# Altium project SMART_WATCH_BOT.PrjPcb
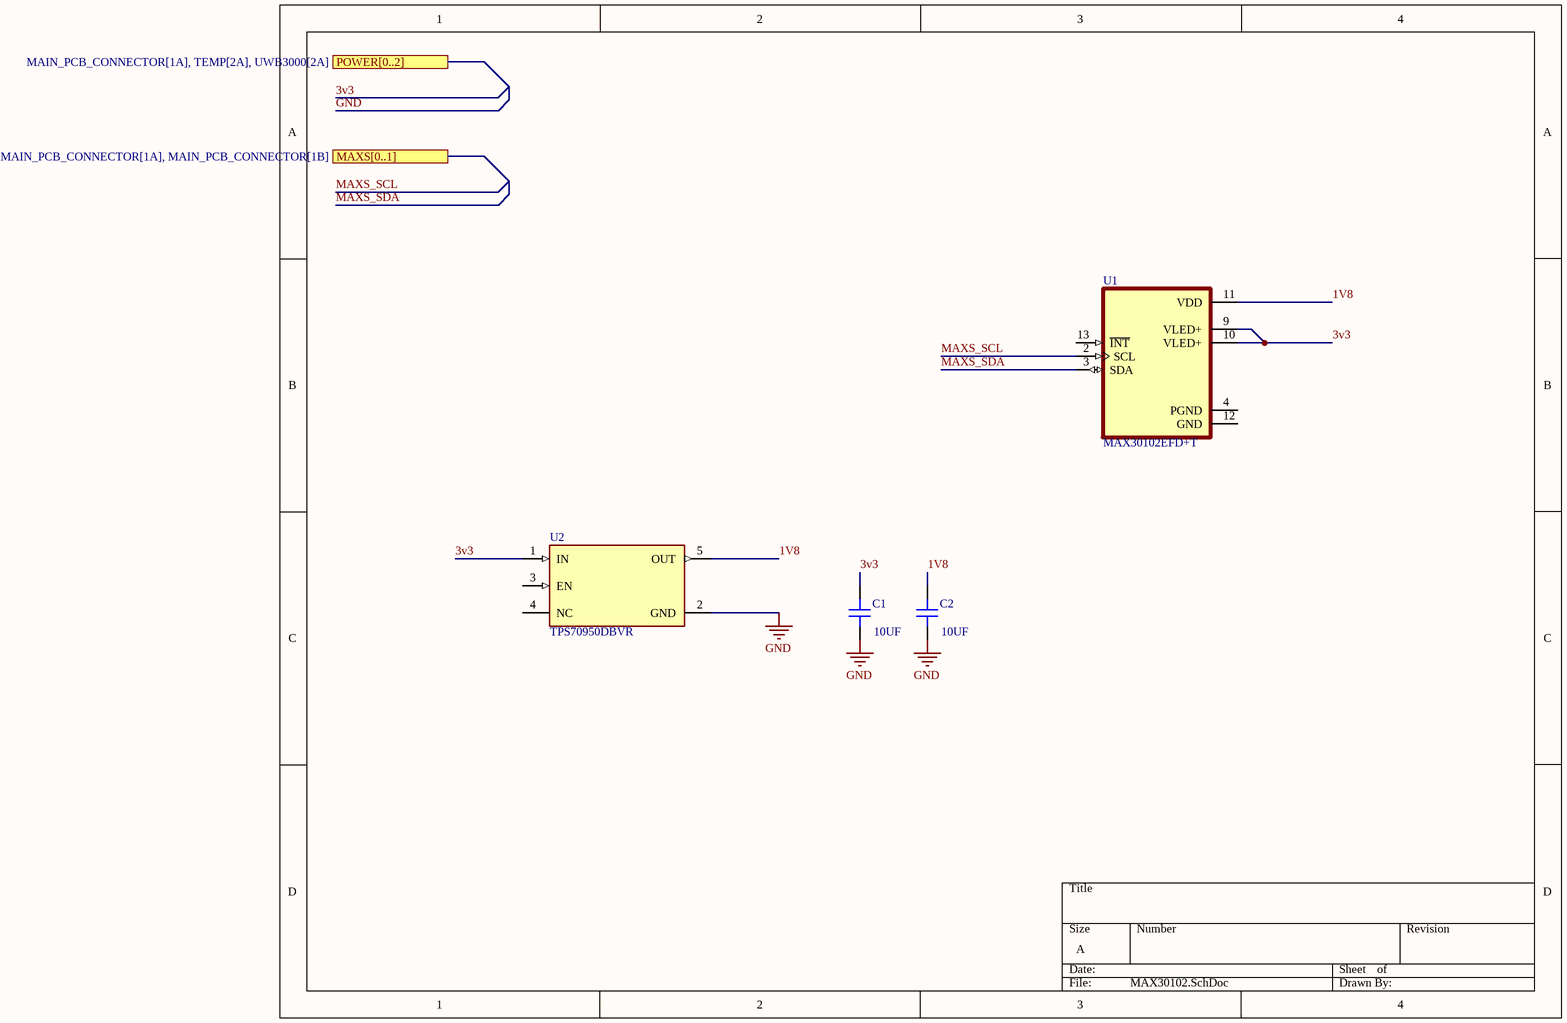
[diagram p0: MAX30102.SchDoc]
4 sheets, 14 parts. Net scope: global (net labels, ports and power ports of the same name join across sheets).
Board file: PCB2.PcbDoc
Sheets:
  MAX30102.SchDoc
  MAIN_PCB_CONNECTOR.SchDoc
  UWB3000.SchDoc
  TEMP.SchDoc

## Sheet MAX30102.SchDoc
size A; SheetNumber: 1; SheetTotal: 4

### Parts
C1  10UF  [CAP 0402_1005]
C2  10UF  [CAP 0402_1005]
U1  MAX30102EFD+T  [XDCR_MAX30101EFD+]
U2  TPS70950DBVR  [SOT95P280X145-5N]

### Ports
MAXS[0..1] (see MAIN_PCB_CONNECTOR[1A], MAIN_PCB_CONNECTOR[1B]), POWER[0..2] (see MAIN_PCB_CONNECTOR[1A], TEMP[2A], UWB3000[2A])

### Nets
GND: C1.1 C2.1 U2.2(GND)
1V8: C2.2 U1.11(VDD) U2.5(OUT)
3v3: C1.2 U1.9(VLED+) U1.10(VLED+) U2.1(IN)
MAXS_SCL: U1.2(SCL)
MAXS_SDA: U1.3(SDA)

Not connected (* = marked no-connect by the designer): U1 4(PGND) 12(GND) 13(~{INT}); U2 3(EN) 4(NC)

### Library data of the parts
C1 C2 = 0402X106M6R3CT: CAP CER 10UF 6.3V X5R 0402; MFR.Part #: CL05A106MQ5NUNC; Manufacturer: Samsung Electro-Mechanics; JLCPCB Part #: C15525; value: 10UF
U1 = MAX30102EFD+T: Pulse Oximeter and Heart Rate Sensor Digital Output; Manufacturer: Analog Devices Inc./Maxim Integrated; JLCPCB Part #: C6454833; MFR.Part #: MAX30102EFD+T
U2 = TPS70950DBVR: Manufacturer: Texas Instruments; JLCPCB Part #: C96028; MFR.Part #: TPS70950DBVR

## Sheet MAIN_PCB_CONNECTOR.SchDoc
size A; SheetNumber: 2; SheetTotal: 4
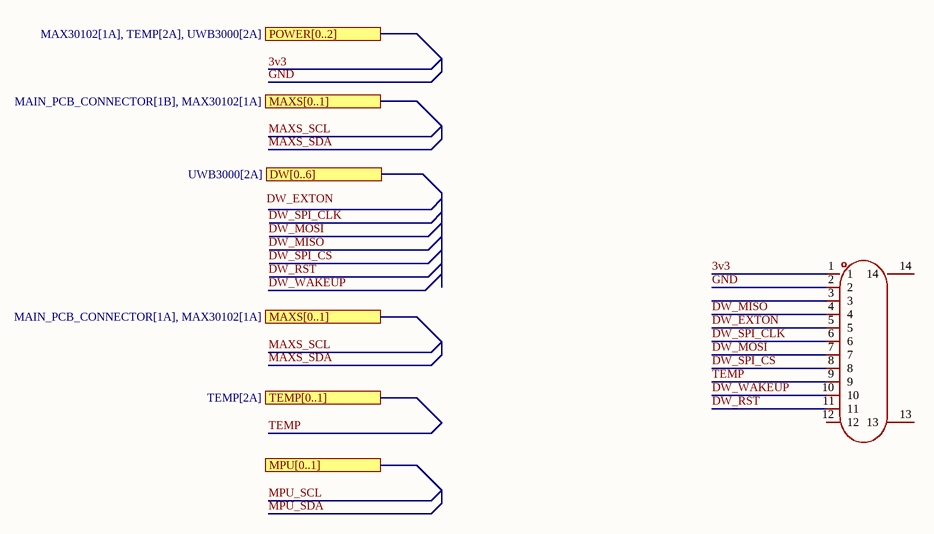
[diagram p1: MAIN_PCB_CONNECTOR.SchDoc]

### Parts
FPC1  FH12-12S-0.5SH(55)  [FPC-SMD_FH12-12S-0.5SH-55]  (value not drawn)

### Ports
DW[0..6] (see UWB3000[2A]), MAXS[0..1] (see MAIN_PCB_CONNECTOR[1A], MAX30102[1A]), MAXS[0..1] (see MAIN_PCB_CONNECTOR[1B], MAX30102[1A]), MPU[0..1], POWER[0..2] (see MAX30102[1A], TEMP[2A], UWB3000[2A]), TEMP[0..1] (see TEMP[2A])

### Nets
GND: FPC1.2
3v3: FPC1.1
DW_EXTON: FPC1.5
DW_MISO: FPC1.4
DW_MOSI: FPC1.7
DW_RST: FPC1.11
DW_SPI_CLK: FPC1.6
DW_SPI_CS: FPC1.8
DW_WAKEUP: FPC1.10
TEMP: FPC1.9

Not connected (* = marked no-connect by the designer): FPC1 3 12 13 14

### Notes on the sheet
- Labels drawn without touching a wire or pin: DW_EXTON, DW_MISO, DW_MOSI, DW_RST, DW_SPI_CLK, DW_SPI_CS

### Library data of the parts
FPC1 = FH12-12S-0.5SH(55): Manufacturer: HRS(Hirose); MFR.Part #: FH12-12S-0.5SH(55); JLCPCB Part #: C88360

## Sheet UWB3000.SchDoc
size A; SheetNumber: 3; SheetTotal: 4
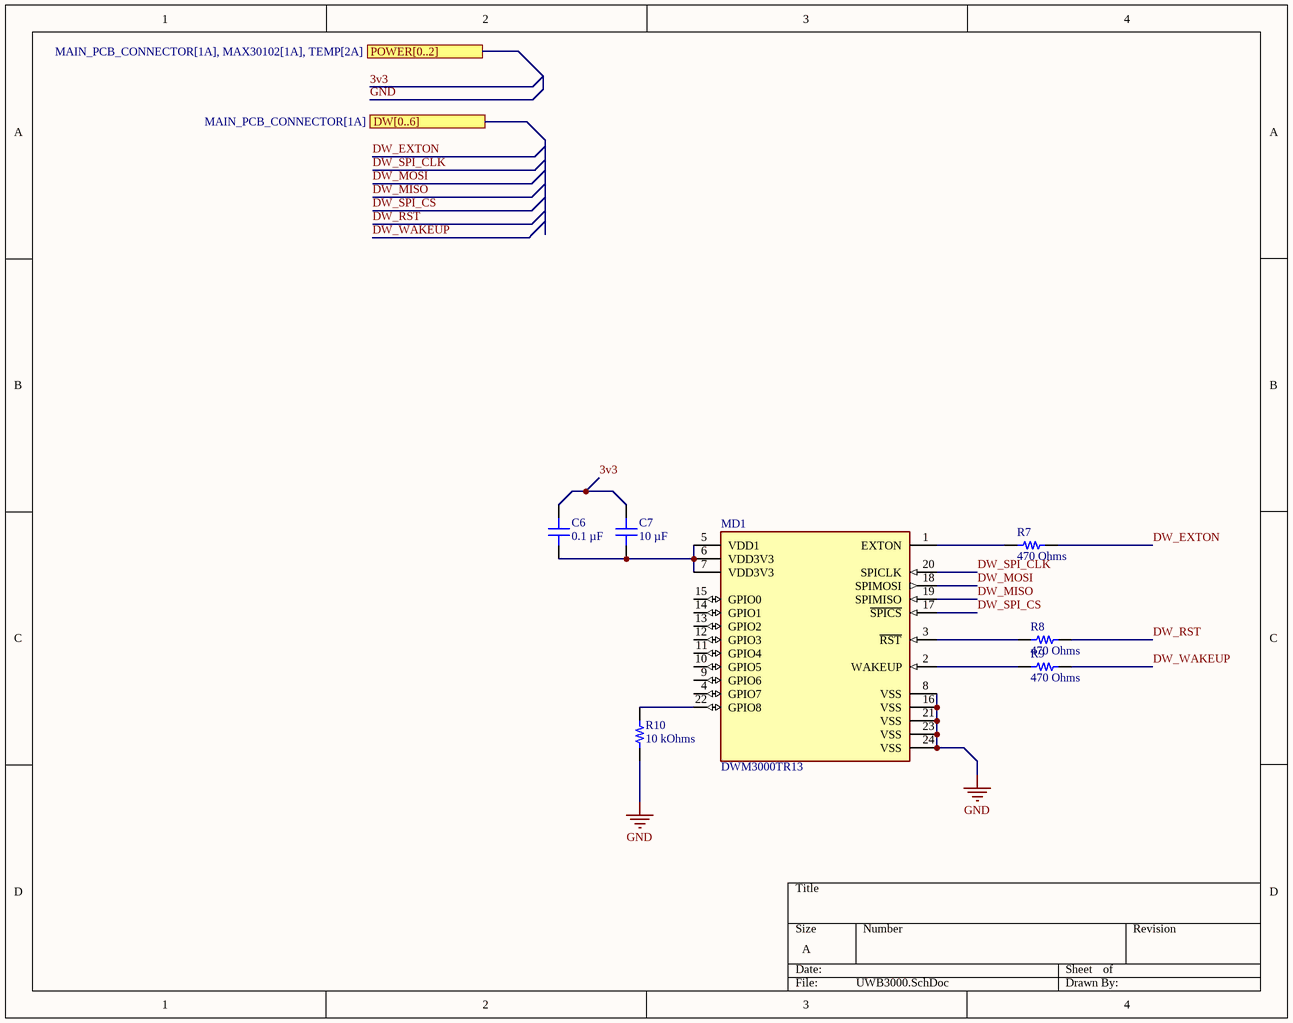
[diagram p2: UWB3000.SchDoc]

### Parts
C6  Capacitance: 0.1 µF  [CAP 0402_1005]
C7  Capacitance: 10 µF  [CAP 0402_1005]
MD1  DWM3000TR13  [FP-DWM3000TR13-MFG]
R7  470 Ohms  [RES 0402_1005]
R8  470 Ohms  [RES 0402_1005]
R9  470 Ohms  [RES 0402_1005]
R10  10 kOhms  [RES 0402_1005]

### Ports
DW[0..6] (see MAIN_PCB_CONNECTOR[1A]), POWER[0..2] (see MAIN_PCB_CONNECTOR[1A], MAX30102[1A], TEMP[2A])

### Nets
GND: MD1.8(VSS) MD1.16(VSS) MD1.21(VSS) MD1.23(VSS) MD1.24(VSS) R10.1
3v3: C6.2 C7.2
DW_EXTON: R7.2
DW_MISO: MD1.19(SPIMISO)
DW_MOSI: MD1.18(SPIMOSI)
DW_RST: R8.2
DW_SPI_CLK: MD1.20(SPICLK)
DW_SPI_CS: MD1.17(~{SPICS})
DW_WAKEUP: R9.2
NetC6_1: C6.1 C7.1 MD1.5(VDD1) MD1.6(VDD3V3) MD1.7(VDD3V3)
NetMD1_1: MD1.1(EXTON) R7.1
NetMD1_2: MD1.2(WAKEUP) R9.1
NetMD1_3: MD1.3(~{RST}) R8.1
NetMD1_22: MD1.22(GPIO8) R10.2

Not connected (* = marked no-connect by the designer): MD1 4(GPIO7) 9(GPIO6) 10(GPIO5) 11(GPIO4) 12(GPIO3) 13(GPIO2) 14(GPIO1) 15(GPIO0)

### Notes on the sheet
- Labels drawn without touching a wire or pin: DW_MISO, DW_MOSI, DW_RST, DW_SPI_CLK, DW_SPI_CS

### Library data of the parts
C6 = 0402B104J160CT: CAP CER 0.1UF 16V X7R 0402; Manufacturer: Samsung Electro-Mechanics; MFR.Part #: CL05B104KO5NNNC; JLCPCB Part #: C1525
C7 = 0402X106M6R3CT: CAP CER 10UF 6.3V X5R 0402; Manufacturer: Samsung Electro-Mechanics; MFR.Part #: CL05A106MQ5NUNC; JLCPCB Part #: C15525
MD1 = CMP-231853-000002-1: DWM3000 module Freq: 7.9872 GHz 6.8Mbps SPI 2.5-3.6V 8 GPIO's; Manufacturer: Qorvo; MFR.Part #: DWM3000TR13; JLCPCB Part #: C5299931
R7-R9 = TNPW0402470RBYEP: RES 470 OHM 0.1% 1/16W 0402; Manufacturer: UNI-ROYAL(Uniroyal Elec); MFR.Part #: 0402WGF4700TCE; Value: 470 Ohms; ComponentLink1Description: Datasheet; ComponentLink1URL: http://www.vishay.com/docs/28758/tnpw_e3.pdf; ComponentLink2Description: DigiKey Link; ComponentLink2URL: http://digikey.com/product-detail/en/vishay-dale/TNPW0402470RBYEP/541-9810-1-ND/9562435; JLCPCB Part #: C25117
R10 = RP73PF1E10KBTD: RES 10K OHM 0.1% 1/10W 0402; Manufacturer: Ever Ohms Tech; MFR.Part #: TR0402D10K0Q1025Z; Value: 10 kOhms; ComponentLink1Description: Datasheet; ComponentLink1URL: https://www.te.com/commerce/DocumentDelivery/DDEController?Action=srchrtrv&DocNm=1773272&DocType=DS&DocLang=English; ComponentLink2Description: DigiKey Link; ComponentLink2URL: https://www.digikey.com/en/products/detail/te-connectivity-passive-product/RP73PF1E10KBTD/8260957; JLCPCB Part #: C149898

## Sheet TEMP.SchDoc
size A; SheetNumber: 4; SheetTotal: 4
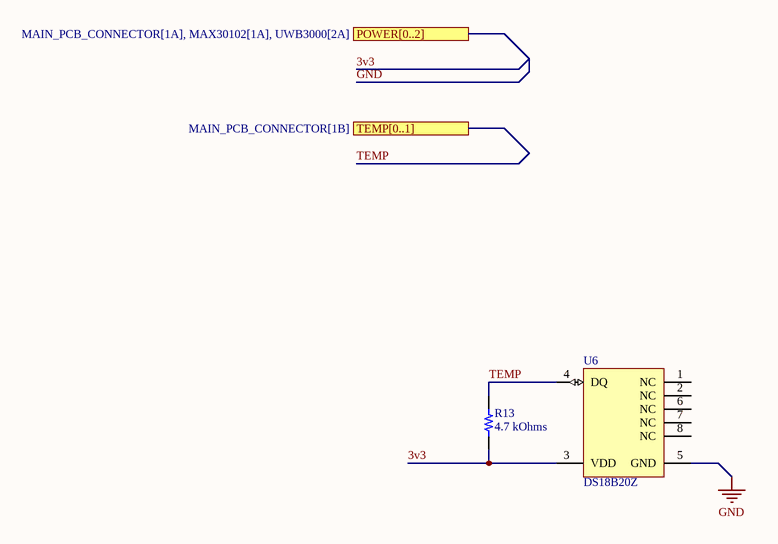
[diagram p3: TEMP.SchDoc]

### Parts
R13  4.7 kOhms  [RES 0402_1005]
U6  DS18B20Z  [MAXM-S8-2_N]

### Ports
POWER[0..2] (see MAIN_PCB_CONNECTOR[1A], MAX30102[1A], UWB3000[2A]), TEMP[0..1] (see MAIN_PCB_CONNECTOR[1B])

### Nets
GND: U6.5(GND)
3v3: R13.1 U6.3(VDD)
TEMP: R13.2 U6.4(DQ)

Not connected (* = marked no-connect by the designer): U6 1(NC) 2(NC) 6(NC) 7(NC) 8(NC)

### Library data of the parts
R13 = RR0510P-472-D: RES SMD 4.7K OHM 0.5% 1/16W 0402; Manufacturer: UNI-ROYAL(Uniroyal Elec); MFR.Part #: 0402WGF4701TCE; Power (Watts): 0.063W, 1/16W; Temperature Coefficient: ±25ppm/°C; Part Number: RR0510P-472-D; Value: 4.7 kOhms; ComponentLink1Description: Datasheet; ComponentLink1URL: http://www.susumu.co.jp/common/pdf/n_catalog_partition05_en.pdf; ComponentLink2Description: DigiKey Link; ComponentLink2URL: https://www.digikey.com/en/products/detail/susumu/RR0510P-472-D/432413; Composition: Thin Film; Device Package: 0402 (1005 Metric); Height - Seated (Max): 0.016" (0.40mm); LastUpdated: 2/9/2024 8:30:21 PM; Lifecycle Status: Active; Minimum Order: 1; Number of Terminations: 2; Operating Temperature: -55°C ~ 125°C; Package / Case: 0402 (1005 Metric); Packaging: TapeAndReel; PartId: 3209; Part Status: Active; Price: 0.01; Resistance: 4.7 kOhms; Series: RR; Size / Dimension: 0.039" L x 0.020" W (1.00mm x 0.50mm); Supplier 1: DigiKey; Supplier Part Number 1: RR05P4.7KDCT-ND; Tolerance: ±0.5%; JLCPCB Part #: C25900
U6 = CMP-0253-00023-2: High-Precision 1-Wire Digital Thermometer, -55 to 125 degC, 8-Pin SOIC (S8-2); Manufacturer: Analog Devices Inc./Maxim Integrated; MFR.Part #: DS18B20Z+T&R; Parasite Pwr.: Yes; Temp. Thresh.: Programmable (NV); Sensor Type: Local; Code_JEDEC: MS012; Mounting Technology: Surface Mount; ComponentLink3Description: Package Specification; PartNumber: DS18B20Z; ComponentLink2Description: Datasheet; ComponentLink3URL: http://pdfserv.maximintegrated.com/package_dwgs/21-0041.PDF; PackageVersion: Rev. D, 10/2012; ComponentLink1URL: http://www.maximintegrated.com/; Multi Droppable: Yes; ComponentLink1Description: Manufacturer URL; ComponentLink2URL: http://datasheets.maximintegrated.com/en/ds/DS18B20.pdf; Generic Part Number: DS18B20; PackageReference: S8-2; PackageDescription: 8-Pin Small-Outline IC, Narrow (0.15in) (S8-2), Body 4.90 x 3.90 mm, Pitch 1.27 mm; Interface: 1-Wire; DatasheetVersion: Rev. 4; Parameter 1: *; JLCPCB Part #: C97190

## Nets that join several sheets
GND: MAX30102 (C1.1 C2.1 U2.2), MAIN_PCB_CONNECTOR (FPC1.2), UWB3000 (6 pins), TEMP (U6.5)
3v3: MAX30102 (C1.2 U1.9 U1.10 U2.1), MAIN_PCB_CONNECTOR (FPC1.1), UWB3000 (C6.2 C7.2), TEMP (R13.1 U6.3)
DW_EXTON: MAIN_PCB_CONNECTOR (FPC1.5), UWB3000 (R7.2)
DW_MISO: MAIN_PCB_CONNECTOR (FPC1.4), UWB3000 (MD1.19)
DW_MOSI: MAIN_PCB_CONNECTOR (FPC1.7), UWB3000 (MD1.18)
DW_RST: MAIN_PCB_CONNECTOR (FPC1.11), UWB3000 (R8.2)
DW_SPI_CLK: MAIN_PCB_CONNECTOR (FPC1.6), UWB3000 (MD1.20)
DW_SPI_CS: MAIN_PCB_CONNECTOR (FPC1.8), UWB3000 (MD1.17)
DW_WAKEUP: MAIN_PCB_CONNECTOR (FPC1.10), UWB3000 (R9.2)
TEMP: MAIN_PCB_CONNECTOR (FPC1.9), TEMP (R13.2 U6.4)